# EAGLE design 1wire_slave (EAGLE 7.7.0)
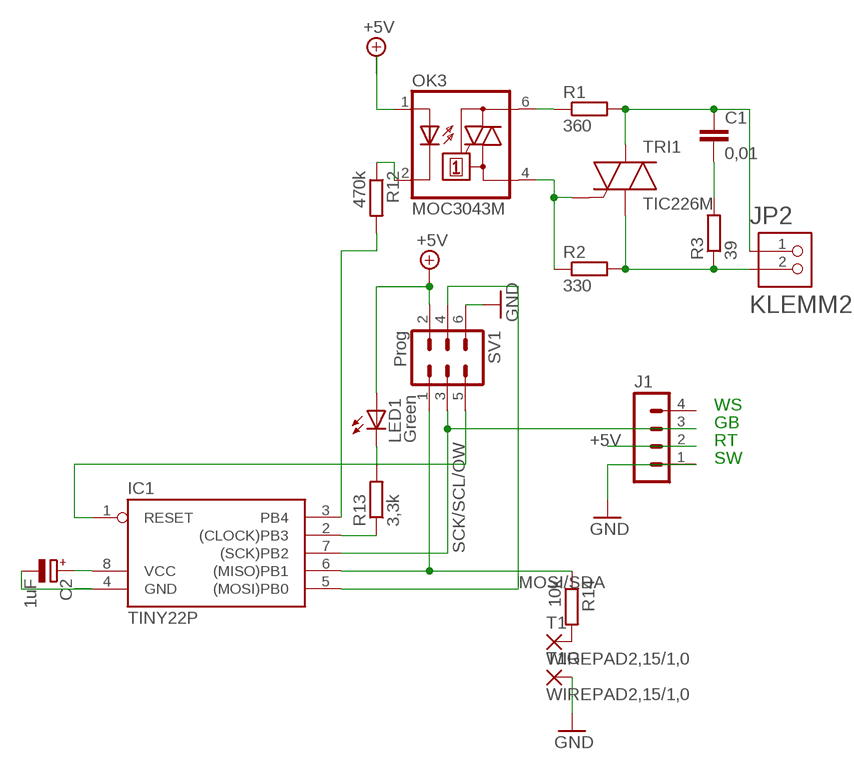
[diagram p0: schematic, sheet 1]

## Parts
C1  0,01  C15/6  [C15B6]
C2  1uF  CPOL-EUE2,5-6E  [E2,5-6E]
IC1  TINY22P  [DIL08]
J1  MA04-1  [MA04-1]
JP2  KLEMM2  [KLEMM2]
LED1  Green  LED3MM  [LED3MM]
OK3  MOC3043M  [DIL06]
R1  360  R-EU_0204/7  [0204/7]
R2  330  R-EU_0204/7  [0204/7]
R3  39  R-EU_0207/15  [0207/15]
R12  470k  R-EU_0207/12  [0207/12]
R13  3,3k  R-EU_0207/10  [0207/10]
R14  10k  R-EU_0204/2V  [0204V]
SV1  Prog  MA03-2  [MA03-2]
T1  WIREPAD2,15/1,0  [2,15/1,0]
T1G  WIREPAD2,15/1,0  [2,15/1,0]
TRI1  TIC226M  [TO-220A]

## Nets
+5V: C2.+ IC1.8(VCC) J1.2 LED1.A OK3.1(A) SV1.2
GND: C2.- IC1.4(GND) J1.1 SV1.6 T1G.1(P)
MOSI/SDA: IC1.5((MOSI)PB0) SV1.4
N$1: JP2.2 R2.2 R3.1 TRI1.1(A1)
N$3: C1.1 JP2.1 R1.2 TRI1.2(A2)
N$4: IC1.3(PB4) R12.2
N$5: R14.2 T1.1(P)
N$6: OK3.4(A1) R2.1 TRI1.3(G)
N$7: C1.2 R3.2
N$8: OK3.6(A2) R1.1
N$9: OK3.2(C) R12.1
N$10: IC1.2((CLOCK)PB3) R13.1
N$17: LED1.K(C) R13.2
RESET: IC1.1(RESET) SV1.5
SCK/SCL/OW: IC1.7((SCK)PB2) J1.3 SV1.3
SHWO: IC1.6((MISO)PB1) R14.1 SV1.1
Unconnected: J1.4

## Notes on the sheet
- WS
- GB
- RT
- SW

## Library data of the parts
C1 = capacitor-wima:C: CAPACITOR naming: grid - package width
C2 = resistor:CPOL-EU: POLARIZED CAPACITOR, European symbol
IC1 = atmel:TINY22: MICROCONTROLLER 1K ROM 128 bytes RAM 128 bytes EEPROM; OC_FARNELL: unknown; OC_NEWARK: unknown
J1 = con-lstb:MA04-1: PIN HEADER; OC_FARNELL: unknown; OC_NEWARK: unknown
JP2 = PINHEAD:KLEMM2
LED1 = led:LED: LED OSRAM: - CHIPLED LG R971, LG N971, LY N971, LG Q971, LY Q971, LO R971, LY R971 LH N974, LH R974 LS Q976, LO Q976, LY Q976 LO Q996 - Hyper CHIPLED LW Q18S LB Q993, LB Q99A, LB R99A - SideLED LS A670, LO A670, LY A670, LG A670, LP A670 LB A673, LV A673, LT A673, LW A673 LH A674 LY A675 LS A676, LA A676, LO A676, LY A676, LW A676 LS A679, LY A679, LG A679 - Hyper Micro SIDELED® LS Y876, LA Y876, LO Y876, LY Y876 LT Y87S - SmartLED LW L88C, LW L88S LB L89C, LB L89S, LG L890 LS L89K, LO L89K, LY L89K LS L896, LA L896, LO L896, LY L896 - TOPLED LS T670, LO T670, LY T670, LG T670, LP T670 LSG T670, LSP T670, LSY T670, LOP T670, LYG T670 LG T671, LOG T671, LSG T671 LB T673, LV T673, LT T673, LW T673 LH T674 LS T676, LA T676, LO T676, LY T676, LB T676, LH T676, LSB T676, LW T676 LB T67C, LV T67C, LT T67C, LS T67K, LO T67K, LY T67K, LW E67C LS E67B, LA E67B, LO E67B, LY E67B, LB E67C, LV E67C, LT E67C LW T67C LS T679, LY T679, LG T679 LS T770, LO T770, LY T770, LG T770, LP T770 LB T773, LV T773, LT T773, LW T773 LH T774 LS E675, LA E675, LY E675, LS T675 LS T776, LA T776, LO T776, LY T776, LB T776 LHGB T686 LT T68C, LB T68C - Hyper Mini TOPLED® LB M676 - Mini TOPLED Santana® LG M470 LS M47K, LO M47K, LY M47K Source: http://www.osram.convergy.de LUXEON: - LUMILED® LXK2-PW12-R00, LXK2-PW12-S00, LXK2-PW14-U00, LXK2-PW14-V00 LXK2-PM12-R00, LXK2-PM12-S00, LXK2-PM14-U00 LXK2-PE12-Q00, LXK2-PE12-R00, LXK2-PE12-S00, LXK2-PE14-T00, LXK2-PE14-U00 LXK2-PB12-K00, LXK2-PB12-L00, LXK2-PB12-M00, LXK2-PB14-N00, LXK2-PB14-P00, LXK2-PB14-Q00 LXK2-PR12-L00, LXK2-PR12-M00, LXK2-PR14-Q00, LXK2-PR14-R00 LXK2-PD12-Q00, LXK2-PD12-R00, LXK2-PD12-S00 LXK2-PH12-R00, LXK2-PH12-S00 LXK2-PL12-P00, LXK2-PL12-Q00, LXK2-PL12-R00 Source: www.luxeon.com KINGBRIGHT: KA-3528ASYC Source: www.kingbright.com
OK3 = optocoupler:MOC30*: 6-Pin DIP Zero-Cross Optoisolators Triac Driver Output (250/400 Volt Peak) Source: Data sheet <http://www.fairchildsemi.com/ds/MO/MOC3031M.pdf> The old path of data sheet not more available 2013-05-06.; MF: FAIRCHILD SEMICONDUCTOR; MPN: MOC3043-M; OC_FARNELL: 1021371; OC_NEWARK: 72K8900
R1-R3 R12 R13 = resistor:R-EU_: RESISTOR, European symbol
R14 = rcl:R-EU_: RESISTOR, European symbol
SV1 = con-lstb:MA03-2: PIN HEADER; OC_FARNELL: unknown; OC_NEWARK: unknown
T1 T1G = wirepad:WIREPAD: Wire PAD connect wire on PCB
TRI1 = SEMICON:TIC226M

## Board
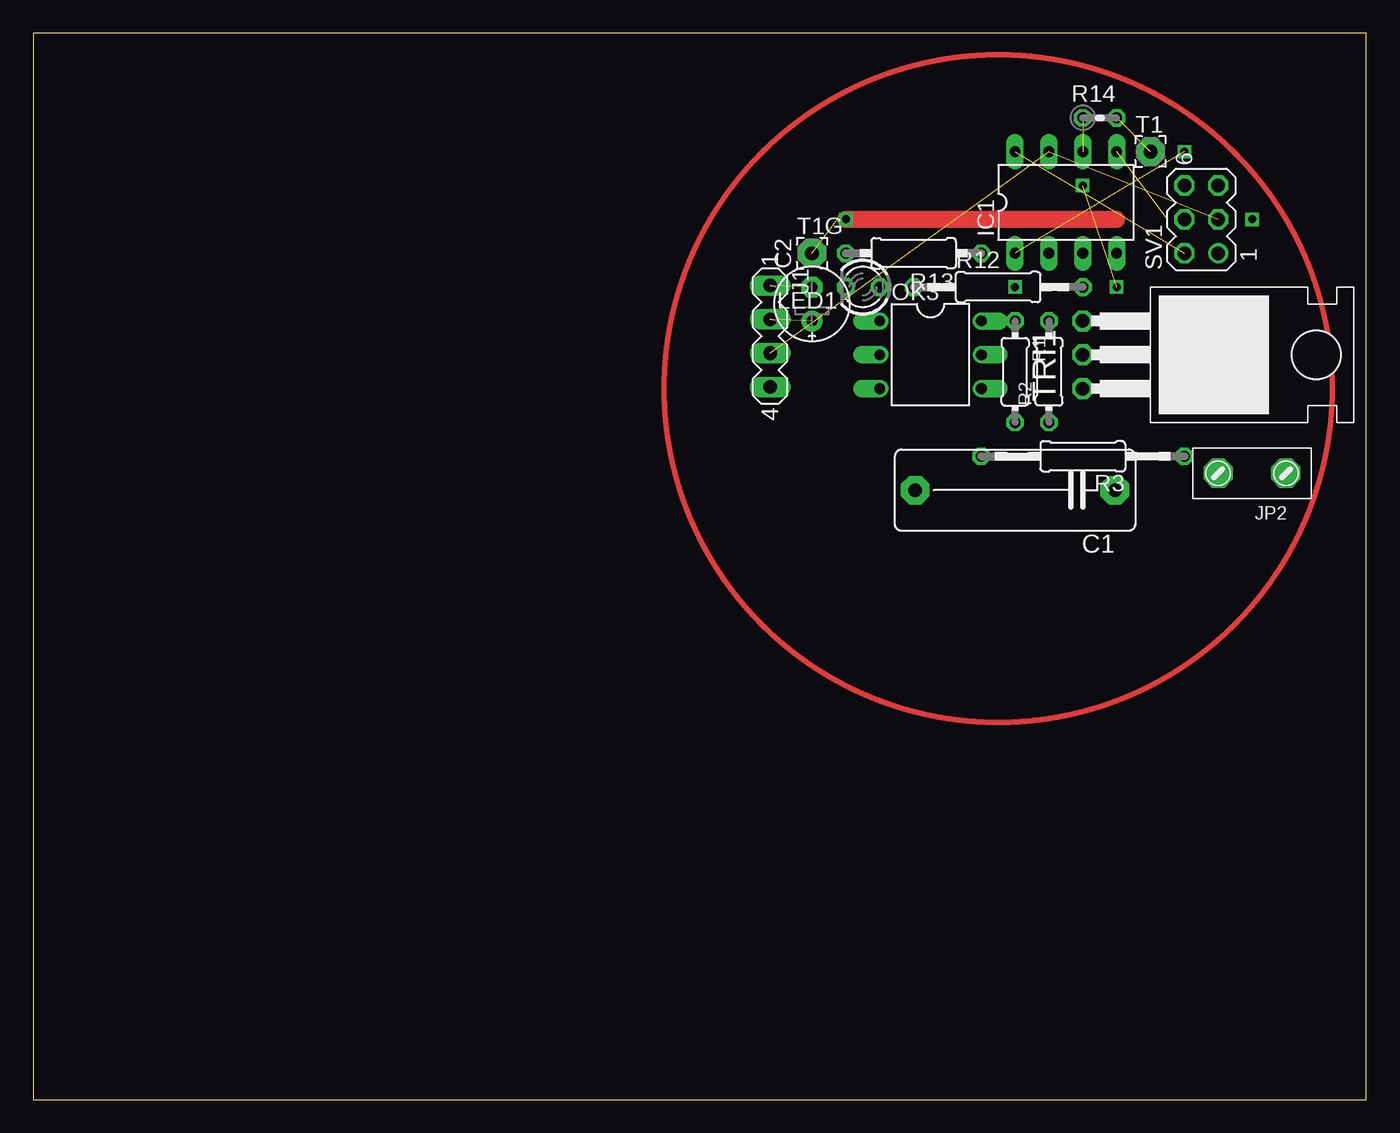
[diagram p1: board, top side]
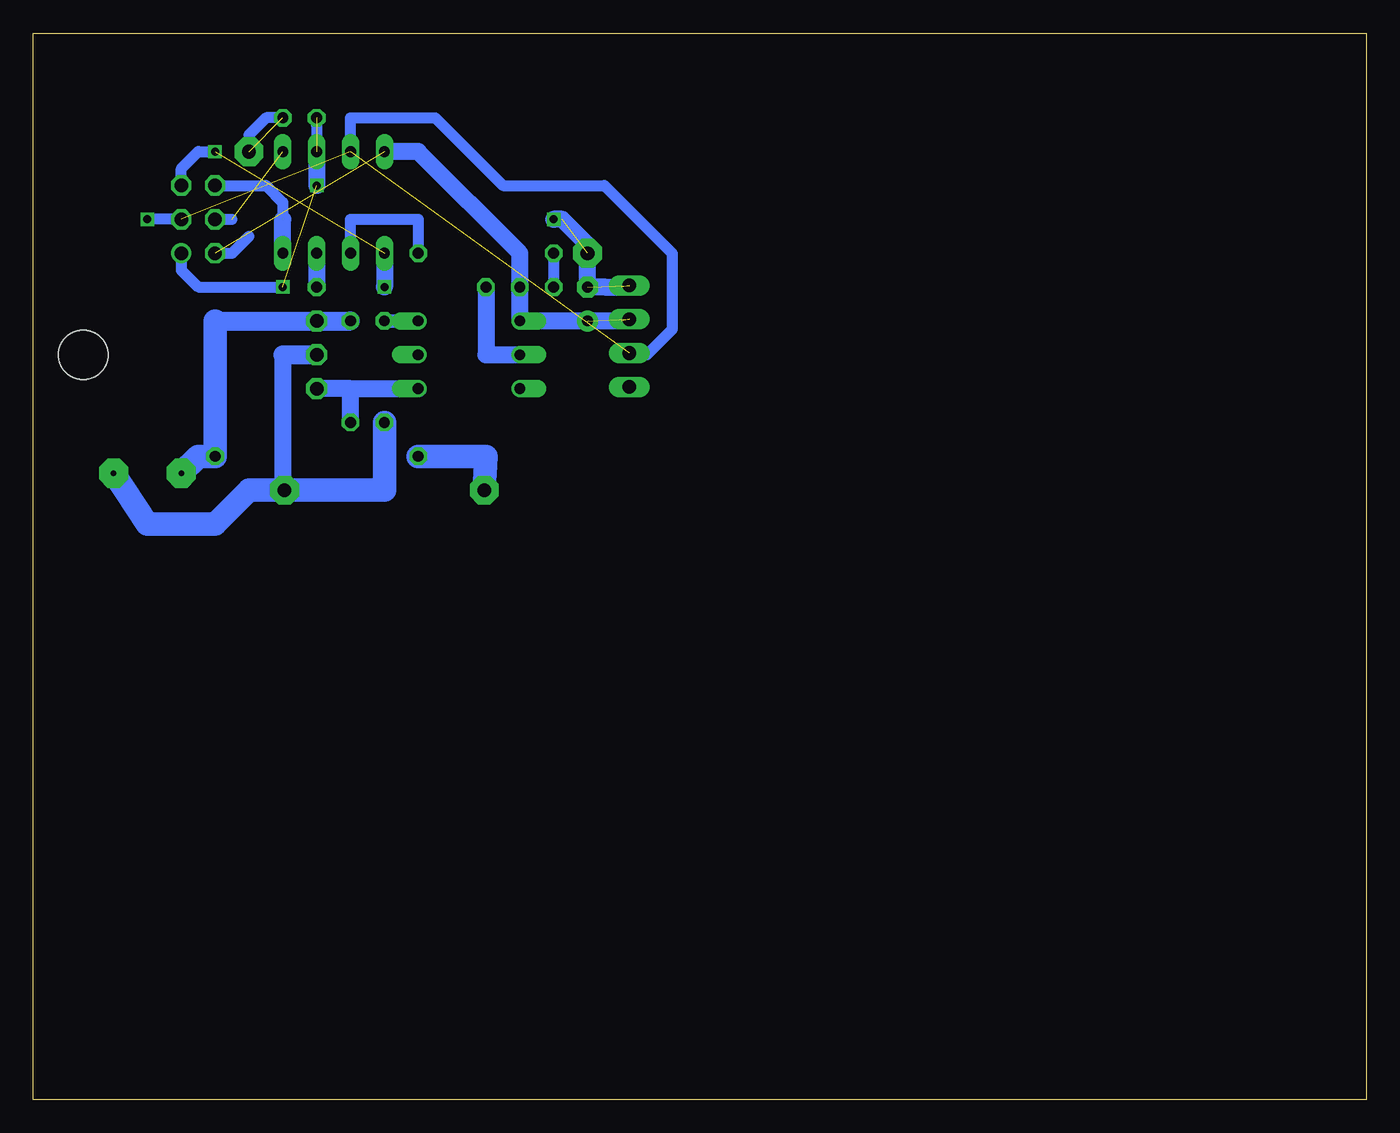
[diagram p2: board, bottom side, seen from below]

Size 100 x 80 mm. Coordinates in mm from the lower left corner, seen from the top.
Outline: 0,0 100,0 100,80 0,80 0,0
Copper layers (1*16): Top 0.035mm / dielectric 1.5mm / Bottom 0.035mm
Design rules "default": minimum track width 10mil, minimum drill 24mil, track to track 8mil, track to pad 8mil, pad to pad 8mil, via to via 8mil, smd to smd 8mil, copper to edge 40mil, drill to drill 8mil, minimum pad ring 10mil, minimum via ring 8mil, stop-mask expansion 4mil, vias tented up to drill 0mil, thermal gap 10mil

### Footprints (pad centres in the part's own frame; a part is rotated, then mirrored left to right if it is on the bottom)
C15B6 = drill 1.016 pad 2.159 octagon: 1 -7.493,0; 2 7.493,0
E2,5-6E = drill 0.813 pad 1.575: + -1.27,0 | drill 0.813 pad 1.575 octagon: - 1.27,0
DIL08 = drill 0.813 long: 1 -3.81,-3.81; 2 -1.27,-3.81; 3 1.27,-3.81; 4 3.81,-3.81; 5 3.81,3.81; 6 1.27,3.81; 7 -1.27,3.81; 8 -3.81,3.81
MA04-1 = drill 1.016 long: 1 -3.81,0; 2 -1.27,0; 3 1.27,0; 4 3.81,0
KLEMM2 = drill 0.406 pad 2.184 octagon: 1 -2.54,0; 2 2.54,0
LED3MM = drill 0.813 octagon: A -1.27,0; K 1.27,0
DIL06 = drill 0.813 offset: 1 -2.54,-3.81; 2 0,-3.81; 3 2.54,-3.81; 4 2.54,3.81; 5 0,3.81; 6 -2.54,3.81
0204/7 = drill 0.813 octagon: 1 -3.81,0; 2 3.81,0
0207/15 = drill 0.813 octagon: 1 -7.62,0; 2 7.62,0
0207/12 = drill 0.813 octagon: 1 -6.35,0; 2 6.35,0
0207/10 = drill 0.813 octagon: 1 -5.08,0; 2 5.08,0
0204V = drill 0.813 octagon: 1 -1.27,0; 2 1.27,0
MA03-2 = drill 1.016: 1 -2.54,-1.27 | drill 1.016 octagon: 2 -2.54,1.27; 3 0,-1.27; 4 0,1.27; 5 2.54,-1.27; 6 2.54,1.27
2,15/1,0 = drill 1.016 pad 2.159 octagon: 1 0,0
TO-220A = drill 1.016 pad 1.575 octagon: 1 -2.54,-10.16; 2 0,-10.16; 3 2.54,-10.16 | hole 3.708: 0,7.366

### Placement (x,y rotation side)
C1  73.66,45.72 180 top
C2  58.42,59.69 90 top
IC1  77.47,67.31 0 top
J1  55.28,57.28 270 top
JP2  91.44,46.99 180 top
LED1  62.23,60.96 180 top
OK3  67.31,55.88 270 top
R1  73.66,54.61 270 top
R2  76.2,54.61 90 top
R3  78.74,48.26 180 top
R12  72.39,60.96 0 top
R13  66.04,63.5 180 top
R14  80.01,73.66 0 top
SV1  87.63,66.04 90 top
T1  83.82,71.12 0 top
T1G  58.42,63.5 0 top
TRI1  88.9,55.88 270 top

### Tracks (layer width: path | path; a pad name or v marks a point on that pad's centre or on a via)
+5V  (via drill 0.6)  (3 unrouted)
  Bottom 0.813: 85.72,63.5 SV1.2 85.09,63.5 83.82,64.77
  Bottom 1.27: IC1.8 71.12,71.12 63.5,63.5 LED1.A OK3.1 55.88,58.42
  other vias: 73.66,71.12
GND  (via drill 0.6)  (4 unrouted)
  Top 1.27: v60.96,66.04 81.28,66.04
  Bottom 0.813: SV1.6 82.55,68.58 81.28,67.31 81.28,66.04
  Bottom 1.27: v60.96,66.04 60.33,66.04 58.42,64.14 C2.- 57.15,60.96 55.88,60.96 | IC1.4 81.28,66.04
MOSI/SDA  (1 unrouted)
  Bottom 0.813: SV1.4 85.09,66.04
N$1
  Bottom 1.422: 86.36,58.42 TRI1.1 R2.2
  Bottom 1.778: JP2.2 87.63,48.26 R3.1 86.36,58.42
N$3
  Bottom 0.813: 81.28,45.72 C1.1
  Bottom 1.27: 81.28,55.88 81.28,45.72
  Bottom 1.422: 81.28,55.88 TRI1.2
  Bottom 1.778: JP2.1 91.44,43.18 86.36,43.18 83.82,45.72 81.28,45.72 | R1.2 73.66,45.72 C1.1
N$4
  Bottom 1.27: IC1.3 R12.2
N$5  (1 unrouted)
  Bottom 0.813: R14.2 82.55,73.66 83.82,72.39 T1.1
N$6
  Bottom 1.27: 76.2,53.34 TRI1.3 | R2.1 76.2,53.34 | 76.2,53.34 OK3.4
N$7
  Bottom 1.778: R3.2 66.04,48.26 C1.2
N$8
  Bottom 1.016: R1.1 OK3.6
N$9
  Bottom 1.27: R12.1 66.04,55.88 OK3.2
N$10
  Bottom 0.813: IC1.2 76.2,66.04 71.12,66.04 R13.1
N$11  (via drill 0.6)
  other vias: 78.74,68.58
N$17
  Bottom 0.813: R13.2 LED1.K
RESET  (via drill 0.6)  (1 unrouted)
  Bottom 0.813: SV1.5 88.9,69.85 87.63,71.12 v86.36,71.12
  Bottom 1.27: IC1.1 v73.66,60.96
SCK/SCL/OW  (via drill 0.6)  (2 unrouted)
  Bottom 0.813: SV1.3 v91.44,66.04 | IC1.7 76.2,73.66 69.85,73.66 64.77,68.58 57.15,68.58 52.07,63.5 52.07,57.78 53.98,55.88 55.78,55.88
SHWO  (via drill 0.6)  (2 unrouted)
  Bottom 0.813: SV1.1 88.9,62.23 87.63,60.96 v81.28,60.96 | 78.74,73.03 R14.1 IC1.6
  Bottom 1.27: IC1.6 78.74,68.58
(copper drawn outside any net)
  shapes: Top circle x1